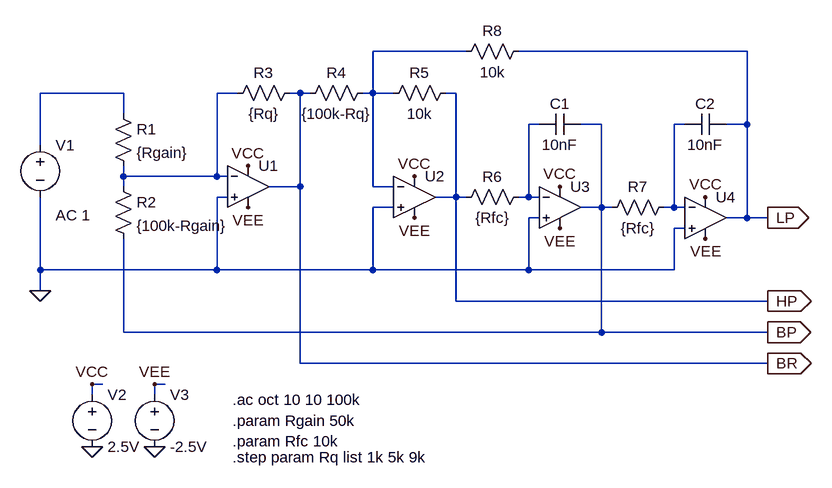
[diagram p0: schematic AD8403_SVF.asc]
AD8403_SVF.asc, the LTspice schematic file:
Version 4
SHEET 1 1040 680
WIRE 480 -64 336 -64
WIRE 912 -64 560 -64
WIRE -48 0 -176 0
WIRE 128 0 96 0
WIRE 224 0 208 0
WIRE 240 0 224 0
WIRE 336 0 336 -64
WIRE 336 0 320 0
WIRE 368 0 336 0
WIRE 464 0 448 0
WIRE -48 32 -48 0
WIRE 592 48 576 48
WIRE 688 48 656 48
WIRE 816 48 800 48
WIRE 912 48 912 -64
WIRE 912 48 880 48
WIRE -176 80 -176 0
WIRE -48 128 -48 112
WIRE 96 128 96 0
WIRE 96 128 -48 128
WIRE 112 128 96 128
WIRE -48 144 -48 128
WIRE 224 144 224 0
WIRE 224 144 176 144
WIRE 336 144 336 0
WIRE 368 144 336 144
WIRE 112 160 96 160
WIRE 464 160 464 0
WIRE 464 160 432 160
WIRE 480 160 464 160
WIRE 576 160 576 48
WIRE 576 160 560 160
WIRE 592 160 576 160
WIRE 368 176 336 176
WIRE 688 176 688 48
WIRE 688 176 656 176
WIRE 704 176 688 176
WIRE 800 176 800 48
WIRE 800 176 784 176
WIRE 816 176 800 176
WIRE 592 192 576 192
WIRE 912 192 912 48
WIRE 912 192 880 192
WIRE 944 192 912 192
WIRE 816 208 800 208
WIRE -176 272 -176 160
WIRE 96 272 96 160
WIRE 96 272 -176 272
WIRE 336 272 336 176
WIRE 336 272 96 272
WIRE 576 272 576 192
WIRE 576 272 336 272
WIRE 800 272 800 208
WIRE 800 272 576 272
WIRE -176 304 -176 272
WIRE 464 320 464 160
WIRE 944 320 464 320
WIRE -48 368 -48 224
WIRE 688 368 688 176
WIRE 688 368 -48 368
WIRE 944 368 688 368
WIRE 224 416 224 144
WIRE 944 416 224 416
WIRE -80 448 -96 448
WIRE 16 448 0 448
WIRE -96 464 -96 448
WIRE 0 464 0 448
FLAG 944 192 LP
IOPIN 944 192 Out
FLAG 944 368 BP
IOPIN 944 368 Out
FLAG 944 416 BR
IOPIN 944 416 Out
FLAG -96 544 0
FLAG 0 544 0
FLAG -96 448 VCC
FLAG 0 448 VEE
FLAG 144 112 VCC
FLAG 400 128 VCC
FLAG 624 144 VCC
FLAG 848 160 VCC
FLAG 144 176 VEE
FLAG 400 192 VEE
FLAG 624 208 VEE
FLAG 848 224 VEE
FLAG -176 304 0
FLAG 944 320 HP
IOPIN 944 320 Out
SYMBOL Opamps\\UniversalOpamp2 144 144 R0
SYMATTR InstName U1
SYMBOL res -64 16 R0
SYMATTR InstName R1
SYMATTR Value {Rgain}
SYMBOL res -64 128 R0
SYMATTR InstName R2
SYMATTR Value {100k-Rgain}
SYMBOL voltage -176 64 R0
WINDOW 123 24 124 Left 2
WINDOW 39 0 0 Left 2
SYMATTR Value2 AC 1
SYMATTR InstName V1
SYMATTR Value ""
SYMBOL Opamps\\UniversalOpamp2 400 160 R0
SYMATTR InstName U2
SYMBOL res 224 -16 R90
WINDOW 0 0 56 VBottom 2
WINDOW 3 32 56 VTop 2
SYMATTR InstName R3
SYMATTR Value {Rq}
SYMBOL res 336 -16 R90
WINDOW 0 0 56 VBottom 2
WINDOW 3 32 56 VTop 2
SYMATTR InstName R4
SYMATTR Value {100k-Rq}
SYMBOL res 464 -16 R90
WINDOW 0 0 56 VBottom 2
WINDOW 3 32 56 VTop 2
SYMATTR InstName R5
SYMATTR Value 10k
SYMBOL res 576 144 R90
WINDOW 0 0 56 VBottom 2
WINDOW 3 32 56 VTop 2
SYMATTR InstName R6
SYMATTR Value {Rfc}
SYMBOL Opamps\\UniversalOpamp2 624 176 R0
SYMATTR InstName U3
SYMBOL cap 656 32 R90
WINDOW 0 0 32 VBottom 2
WINDOW 3 32 32 VTop 2
SYMATTR InstName C1
SYMATTR Value 10nF
SYMBOL res 800 160 R90
WINDOW 0 0 56 VBottom 2
WINDOW 3 32 56 VTop 2
SYMATTR InstName R7
SYMATTR Value {Rfc}
SYMBOL Opamps\\UniversalOpamp2 848 192 R0
SYMATTR InstName U4
SYMBOL cap 880 32 R90
WINDOW 0 0 32 VBottom 2
WINDOW 3 32 32 VTop 2
SYMATTR InstName C2
SYMATTR Value 10nF
SYMBOL voltage -96 448 R0
WINDOW 123 0 0 Left 2
WINDOW 39 0 0 Left 2
SYMATTR InstName V2
SYMATTR Value 2.5V
SYMBOL voltage 0 448 R0
WINDOW 123 0 0 Left 2
WINDOW 39 0 0 Left 2
SYMATTR InstName V3
SYMATTR Value -2.5V
SYMBOL res 576 -80 R90
WINDOW 0 0 56 VBottom 2
WINDOW 3 32 56 VTop 2
SYMATTR InstName R8
SYMATTR Value 10k
TEXT 120 472 Left 2 !.ac oct 10 10 100k
TEXT 120 504 Left 2 !.param Rgain 50k
TEXT 120 560 Left 2 !.step param Rq list 1k 5k 9k
TEXT 120 536 Left 2 !.param Rfc 10k

The netlist it stands for:
* AD8403_SVF.asc
XU1 0 N003 VCC VEE BR level.2 Avol=1Meg GBW=10Meg Slew=10Meg ilimit=25m rail=0 Vos=0 phimargin=45 en=0 enk=0 in=0 ink=0 Rin=500Meg  ; pins IN+ IN- V+ V- OUT
R1 N002 N003 {Rgain}
R2 N003 BP {100k-Rgain}
V1 N002 0 AC 1
XU2 0 N001 VCC VEE HP level.2 Avol=1Meg GBW=10Meg Slew=10Meg ilimit=25m rail=0 Vos=0 phimargin=45 en=0 enk=0 in=0 ink=0 Rin=500Meg  ; pins IN+ IN- V+ V- OUT
R3 BR N003 {Rq}
R4 N001 BR {100k-Rq}
R5 HP N001 10k
R6 N004 HP {Rfc}
XU3 0 N004 VCC VEE BP level.2 Avol=1Meg GBW=10Meg Slew=10Meg ilimit=25m rail=0 Vos=0 phimargin=45 en=0 enk=0 in=0 ink=0 Rin=500Meg  ; pins IN+ IN- V+ V- OUT
C1 BP N004 10nF
R7 N005 BP {Rfc}
XU4 0 N005 VCC VEE LP level.2 Avol=1Meg GBW=10Meg Slew=10Meg ilimit=25m rail=0 Vos=0 phimargin=45 en=0 enk=0 in=0 ink=0 Rin=500Meg  ; pins IN+ IN- V+ V- OUT
C2 LP N005 10nF
V2 VCC 0 2.5V
V3 VEE 0 -2.5V
R8 LP N001 10k
.ac oct 10 10 100k
.param Rgain 50k
.step param Rq list 1k 5k 9k
.param Rfc 10k
.lib UniversalOpamps2.sub
.backanno
.end